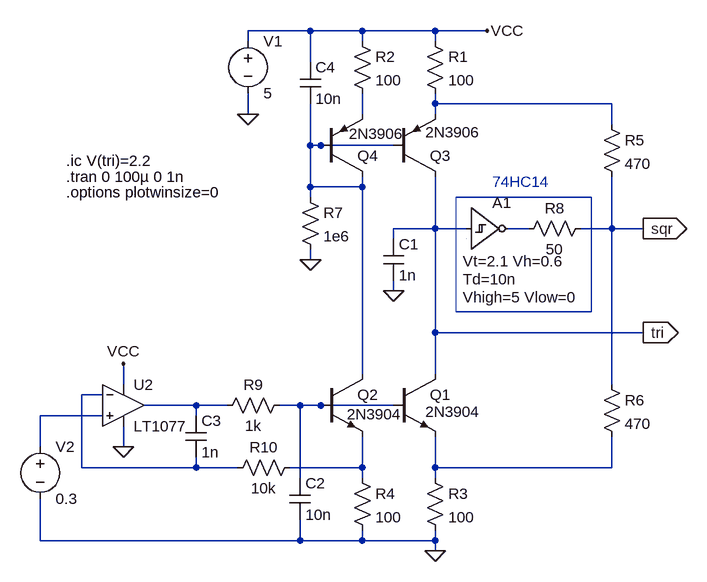
[diagram p0: schematic CmosVCO_a.asc]
CmosVCO_a.asc, the LTspice schematic file:
Version 4
SHEET 1 880 680
WIRE -32 -208 -128 -208
WIRE 48 -208 -32 -208
WIRE 160 -208 48 -208
WIRE 240 -208 160 -208
WIRE -128 -192 -128 -208
WIRE 48 -192 48 -208
WIRE 160 -192 160 -208
WIRE -32 -160 -32 -208
WIRE 160 -96 160 -112
WIRE 432 -96 160 -96
WIRE -128 -80 -128 -112
WIRE 48 -80 48 -112
WIRE 160 -80 160 -96
WIRE 432 -64 432 -96
WIRE -32 -32 -32 -96
WIRE -16 -32 -32 -32
WIRE 96 -32 -16 -32
WIRE -32 32 -32 -32
WIRE 48 32 48 16
WIRE 48 32 -32 32
WIRE -32 48 -32 32
WIRE 160 96 160 16
WIRE 160 96 96 96
WIRE 208 96 160 96
WIRE 304 96 272 96
WIRE 432 96 432 16
WIRE 432 96 384 96
WIRE 480 96 432 96
WIRE 96 112 96 96
WIRE -32 144 -32 128
WIRE 96 192 96 176
WIRE 160 256 160 96
WIRE 480 256 160 256
WIRE 48 320 48 32
WIRE 160 320 160 256
WIRE -320 336 -320 304
WIRE 432 336 432 96
WIRE -352 352 -384 352
WIRE -208 368 -288 368
WIRE -160 368 -208 368
WIRE -48 368 -80 368
WIRE -16 368 -48 368
WIRE 96 368 -16 368
WIRE -352 384 -448 384
WIRE -208 384 -208 368
WIRE -448 432 -448 384
WIRE -320 432 -320 400
WIRE -384 464 -384 352
WIRE -208 464 -208 448
WIRE -208 464 -384 464
WIRE -144 464 -208 464
WIRE 48 464 48 416
WIRE 48 464 -64 464
WIRE 160 464 160 416
WIRE 432 464 432 416
WIRE 432 464 160 464
WIRE -48 480 -48 368
WIRE 48 480 48 464
WIRE 160 480 160 464
WIRE -448 576 -448 512
WIRE -48 576 -48 544
WIRE -48 576 -448 576
WIRE 48 576 48 560
WIRE 48 576 -48 576
WIRE 160 576 160 560
WIRE 160 576 48 576
WIRE 160 592 160 576
FLAG 96 192 0
FLAG 160 592 0
FLAG 480 256 tri
IOPIN 480 256 Out
FLAG 480 96 sqr
IOPIN 480 96 Out
FLAG 240 -208 VCC
FLAG -32 144 0
FLAG -320 304 VCC
FLAG -128 -80 0
FLAG -320 432 0
SYMBOL cap 80 112 R0
SYMATTR InstName C1
SYMATTR Value 1n
SYMBOL npn2 96 320 R0
WINDOW 3 49 58 Left 0
SYMATTR Value 2N3904
SYMATTR InstName Q1
SYMBOL npn2 -16 320 R0
WINDOW 3 40 62 Left 0
SYMATTR Value 2N3904
SYMATTR InstName Q2
SYMBOL pnp2 96 16 M180
WINDOW 3 49 68 Left 0
SYMATTR Value 2N3906
SYMATTR InstName Q3
SYMBOL pnp2 -16 16 M180
WINDOW 3 43 66 Left 0
SYMATTR Value 2N3906
SYMATTR InstName Q4
SYMBOL res 144 -208 R0
SYMATTR InstName R1
SYMATTR Value 100
SYMBOL res 32 -208 R0
SYMATTR InstName R2
SYMATTR Value 100
SYMBOL res 144 464 R0
SYMATTR InstName R3
SYMATTR Value 100
SYMBOL res 32 464 R0
SYMATTR InstName R4
SYMATTR Value 100
SYMBOL res 416 -80 R0
SYMATTR InstName R5
SYMATTR Value 470
SYMBOL res 416 320 R0
SYMATTR InstName R6
SYMATTR Value 470
SYMBOL voltage -128 -208 R0
WINDOW 123 0 0 Left 0
WINDOW 39 0 0 Left 0
SYMATTR InstName V1
SYMATTR Value 5
SYMBOL voltage -448 416 R0
WINDOW 123 0 0 Left 0
WINDOW 39 0 0 Left 0
SYMATTR InstName V2
SYMATTR Value 0.3
SYMBOL Opamps\\LT1077 -320 304 R0
SYMATTR InstName U2
SYMBOL res -48 32 R0
SYMATTR InstName R7
SYMATTR Value 1e6
SYMBOL Digital\\schmtinv 208 32 R0
WINDOW 39 -5 114 Left 0
WINDOW 40 -5 142 Left 0
WINDOW 123 -5 170 Left 0
SYMATTR SpiceLine Vt=2.1 Vh=0.6
SYMATTR SpiceLine2 Td=10n
SYMATTR Value2 Vhigh=5 Vlow=0
SYMATTR InstName A1
SYMBOL res 288 112 R270
WINDOW 0 32 56 VTop 0
WINDOW 3 0 56 VBottom 0
SYMATTR InstName R8
SYMATTR Value 50
SYMBOL cap -64 480 R0
SYMATTR InstName C2
SYMATTR Value 10n
SYMBOL res -176 384 R270
WINDOW 0 32 56 VTop 0
WINDOW 3 0 56 VBottom 0
SYMATTR InstName R9
SYMATTR Value 1k
SYMBOL cap -224 384 R0
SYMATTR InstName C3
SYMATTR Value 1n
SYMBOL res -160 480 R270
WINDOW 0 32 56 VTop 0
WINDOW 3 0 56 VBottom 0
SYMATTR InstName R10
SYMATTR Value 10k
SYMBOL cap -48 -160 R0
SYMATTR InstName C4
SYMATTR Value 10n
TEXT -408 16 Left 0 !.tran 0 100µ 0 1n
TEXT 248 24 Left 0 ;74HC14
TEXT -408 -8 Left 0 !.ic V(tri)=2.2
TEXT -408 40 Left 0 !.options plotwinsize=0
RECTANGLE Normal 400 224 192 48

The netlist it stands for:
* CmosVCO_a.asc
C1 tri 0 1n
Q1 tri N007 N010 0 2N3904
Q2 N003 N007 N009 0 2N3904
Q3 tri N003 N001 0 2N3906
Q4 N003 N003 N002 0 2N3906
R1 VCC N001 100
R2 VCC N002 100
R3 N010 0 100
R4 N009 0 100
R5 N001 sqr 470
R6 sqr N010 470
V1 VCC 0 5
V2 N008 0 0.3
XU2 N008 N005 VCC 0 N006 LT1077  ; pins In+ In- V+ V- OUT
R7 N003 0 1e6
A1 tri 0 0 0 0 N004 0 0 SCHMITT Vhigh=5 Vlow=0 Vt=2.1 Vh=0.6 Td=10n
R8 N004 sqr 50
C2 N007 0 10n
R9 N006 N007 1k
C3 N006 N005 1n
R10 N005 N009 10k
C4 VCC N003 10n
.model NPN NPN
.model PNP PNP
.lib standard.bjt
.tran 0 100µ 0 1n
* 74HC14
.ic V(tri)=2.2
.options plotwinsize=0
.backanno
.end